# EAGLE design billdetector1d (EAGLE 5.11)
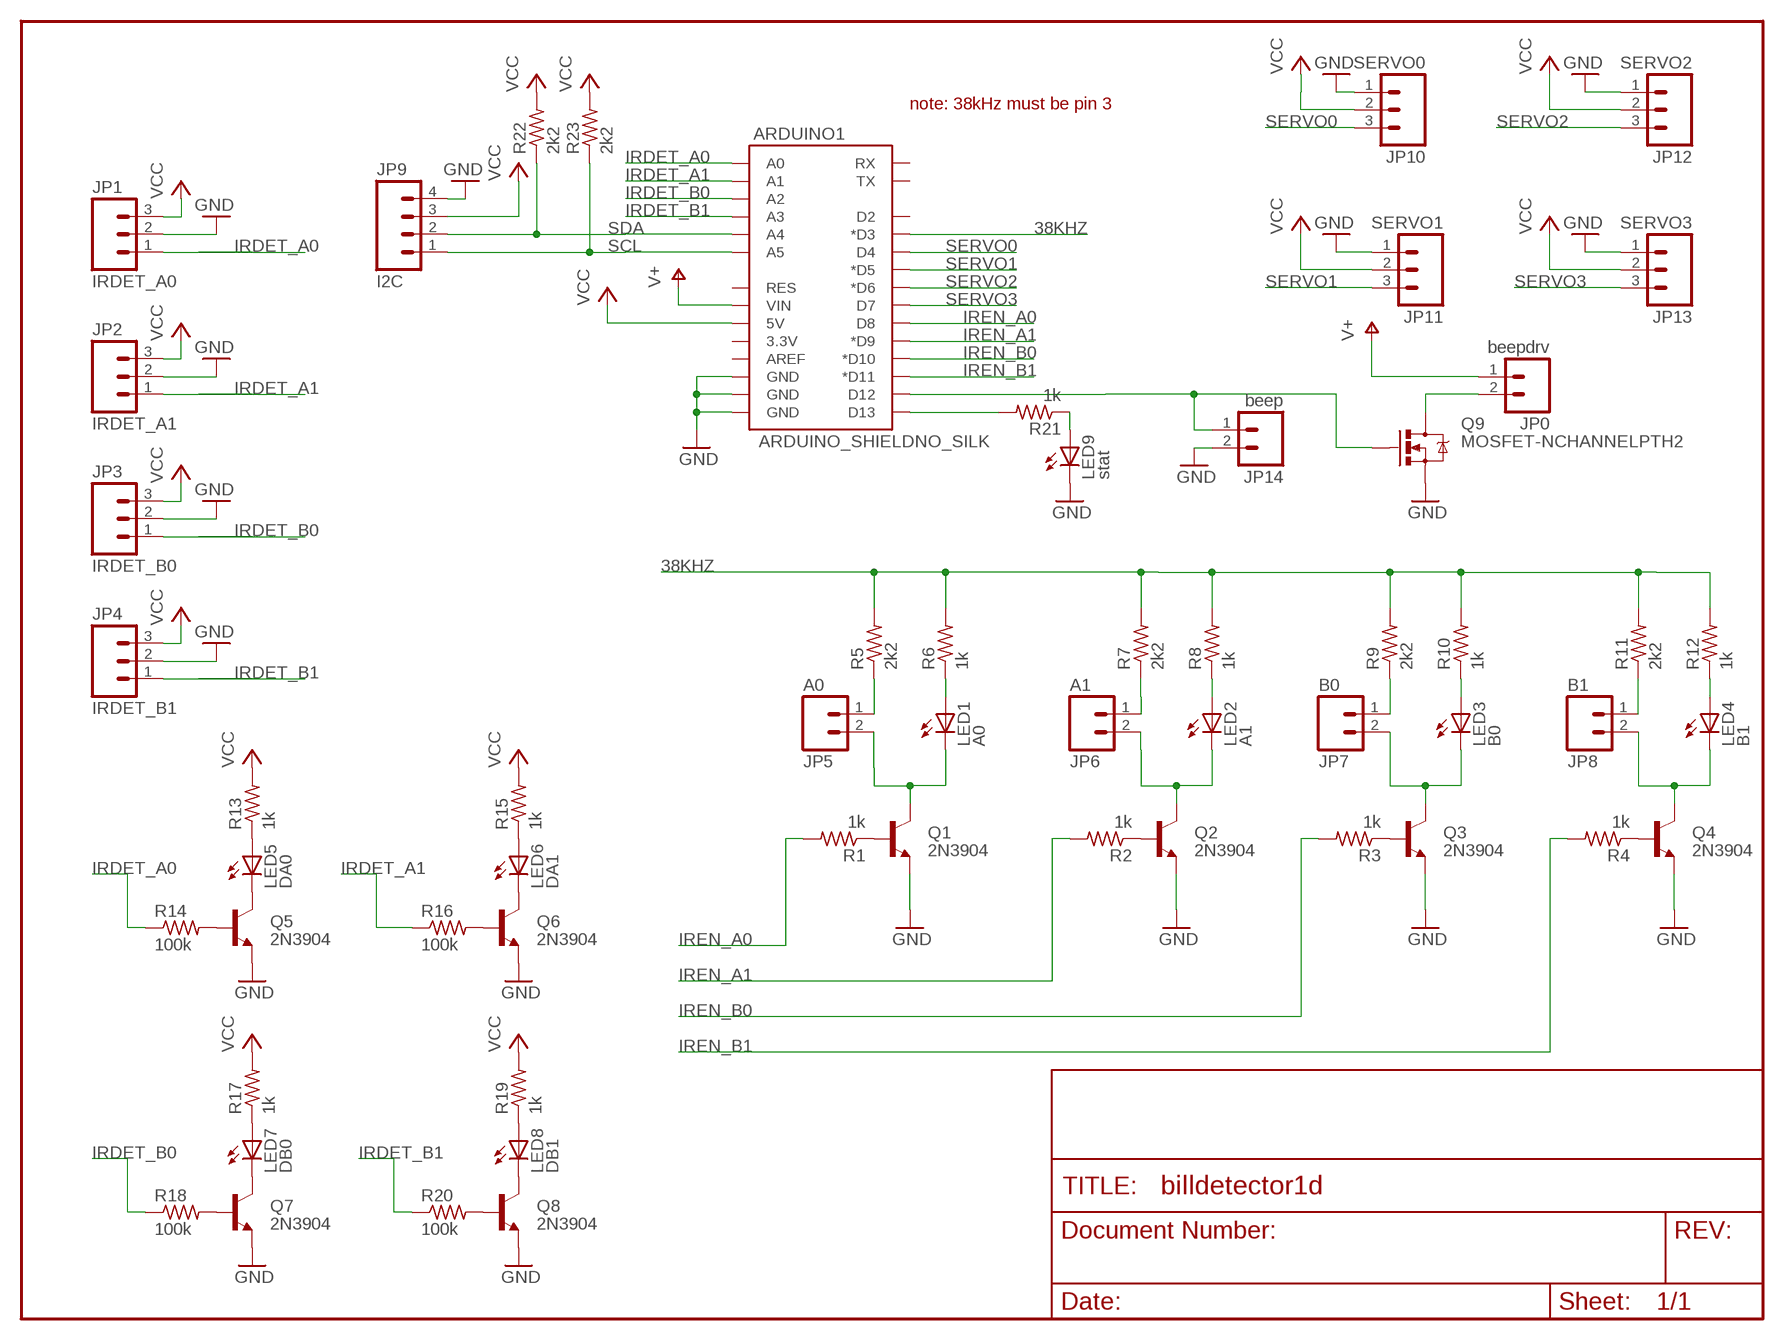
[diagram p0: schematic, sheet 1]

## Parts
ARDUINO1  ARDUINO_SHIELDNO_SILK  [DUEMILANOVE_VIAS]
JP0  beepdrv  M02POLAR_LOCK  [MOLEX-1X2_LOCK]
JP1  IRDET_A0  M03POLAR_LOCK  [MOLEX-1X3_LOCK]
JP2  IRDET_A1  M03POLAR_LOCK  [MOLEX-1X3_LOCK]
JP3  IRDET_B0  M03POLAR_LOCK  [MOLEX-1X3_LOCK]
JP4  IRDET_B1  M03POLAR_LOCK  [MOLEX-1X3_LOCK]
JP5  A0  M02POLAR_LOCK  [MOLEX-1X2_LOCK]
JP6  A1  M02POLAR_LOCK  [MOLEX-1X2_LOCK]
JP7  B0  M02POLAR_LOCK  [MOLEX-1X2_LOCK]
JP8  B1  M02POLAR_LOCK  [MOLEX-1X2_LOCK]
JP9  I2C  M04LOCK  [1X04_LOCK]
JP10  SERVO0  M03LOCK  [1X03_LOCK]
JP11  SERVO1  M03LOCK  [1X03_LOCK]
JP12  SERVO2  M03LOCK  [1X03_LOCK]
JP13  SERVO3  M03LOCK  [1X03_LOCK]
JP14  beep  M02LOCK  [1X02_LOCK]
LED1  A0  LED3MM  [LED3MM]
LED2  A1  LED3MM  [LED3MM]
LED3  B0  LED3MM  [LED3MM]
LED4  B1  LED3MM  [LED3MM]
LED5  DA0  LED3MM  [LED3MM]
LED6  DA1  LED3MM  [LED3MM]
LED7  DB0  LED3MM  [LED3MM]
LED8  DB1  LED3MM  [LED3MM]
LED9  stat  LED3MM  [LED3MM]
Q1  2N3904  TRANSISTOR_NPNTO92  [TO-92]
Q2  2N3904  TRANSISTOR_NPNTO92  [TO-92]
Q3  2N3904  TRANSISTOR_NPNTO92  [TO-92]
Q4  2N3904  TRANSISTOR_NPNTO92  [TO-92]
Q5  2N3904  TRANSISTOR_NPNTO92  [TO-92]
Q6  2N3904  TRANSISTOR_NPNTO92  [TO-92]
Q7  2N3904  TRANSISTOR_NPNTO92  [TO-92]
Q8  2N3904  TRANSISTOR_NPNTO92  [TO-92]
Q9  MOSFET-NCHANNELPTH2  [TO220V]
R1  1k  R-US_0204/2V  [0204V]
R2  1k  R-US_0204/2V  [0204V]
R3  1k  R-US_0204/2V  [0204V]
R4  1k  R-US_0204/2V  [0204V]
R5  2k2  R-US_0204/2V  [0204V]
R6  1k  R-US_0204/2V  [0204V]
R7  2k2  R-US_0204/2V  [0204V]
R8  1k  R-US_0204/2V  [0204V]
R9  2k2  R-US_0204/2V  [0204V]
R10  1k  R-US_0204/2V  [0204V]
R11  2k2  R-US_0204/2V  [0204V]
R12  1k  R-US_0204/2V  [0204V]
R13  1k  R-US_0204/2V  [0204V]
R14  100k  R-US_0204/2V  [0204V]
R15  1k  R-US_0204/2V  [0204V]
R16  100k  R-US_0204/2V  [0204V]
R17  1k  R-US_0204/2V  [0204V]
R18  100k  R-US_0204/2V  [0204V]
R19  1k  R-US_0204/2V  [0204V]
R20  100k  R-US_0204/2V  [0204V]
R21  1k  R-US_0204/2V  [0204V]
R22  2k2  R-US_0204/2V  [0204V]
R23  2k2  R-US_0204/2V  [0204V]

## Nets
38KHZ: ARDUINO1.D3(*D3) R5.2 R6.2 R7.2 R8.2 R9.2 R10.2 R11.2 R12.2
GND: ARDUINO1.GND@0(GND) ARDUINO1.GND@1(GND) ARDUINO1.GND@2(GND) JP1.2 JP2.2 JP3.2 JP4.2 JP9.4 JP10.1 JP11.1 JP12.1 JP13.1 JP14.2 LED9.K(C) Q1.1(E) Q2.1(E) Q3.1(E) Q4.1(E) Q5.1(E) Q6.1(E) Q7.1(E) Q8.1(E) Q9.3(S)
IRDET_A0: ARDUINO1.A0 JP1.1 R14.1
IRDET_A1: ARDUINO1.A1 JP2.1 R16.1
IRDET_B0: ARDUINO1.A2 JP3.1 R18.1
IRDET_B1: ARDUINO1.A3 JP4.1 R20.1
IREN_A0: ARDUINO1.D8 R1.2
IREN_A1: ARDUINO1.D9(*D9) R2.2
IREN_B0: ARDUINO1.D10(*D10) R3.2
IREN_B1: ARDUINO1.D11(*D11) R4.2
N$1: Q3.2(B) R3.1
N$2: Q4.2(B) R4.1
N$3: JP6.1 R7.1
N$4: JP5.2 LED1.K(C) Q1.3(C)
N$5: Q1.2(B) R1.1
N$6: Q2.2(B) R2.1
N$7: ARDUINO1.D12 JP14.1 Q9.1(G)
N$8: ARDUINO1.D13 R21.2
N$9: LED1.A R6.1
N$10: LED2.A R8.1
N$11: JP6.2 LED2.K(C) Q2.3(C)
N$12: LED5.A R13.1
N$13: JP5.1 R5.1
N$14: LED5.K(C) Q5.3(C)
N$15: LED3.A R10.1
N$16: LED4.A R12.1
N$17: JP7.1 R9.1
N$18: JP8.1 R11.1
N$19: JP7.2 LED3.K(C) Q3.3(C)
N$20: JP8.2 LED4.K(C) Q4.3(C)
N$21: Q5.2(B) R14.2
N$22: LED6.A R15.1
N$23: LED6.K(C) Q6.3(C)
N$24: Q6.2(B) R16.2
N$25: LED7.A R17.1
N$26: LED7.K(C) Q7.3(C)
N$27: Q8.2(B) R20.2
N$28: LED8.A R19.1
N$29: LED8.K(C) Q8.3(C)
N$30: Q7.2(B) R18.2
N$31: LED9.A R21.1
N$32: JP0.2 Q9.2(D)
SCL: ARDUINO1.A5 JP9.1 R23.1
SDA: ARDUINO1.A4 JP9.2 R22.1
SERVO0: ARDUINO1.D4 JP10.3
SERVO1: ARDUINO1.D5(*D5) JP11.3
SERVO2: ARDUINO1.D6(*D6) JP12.3
SERVO3: ARDUINO1.D7 JP13.3
V+: ARDUINO1.VIN JP0.1
VCC: ARDUINO1.5V JP1.3 JP2.3 JP3.3 JP4.3 JP9.3 JP10.2 JP11.2 JP12.2 JP13.2 R13.2 R15.2 R17.2 R19.2 R22.2 R23.2
Unconnected: ARDUINO1.3.3V ARDUINO1.AREF ARDUINO1.D2 ARDUINO1.RES ARDUINO1.RX ARDUINO1.TX

## Notes on the sheet
- note: 38kHz must be pin 3

## Library data of the parts
ARDUINO1 = SparkFun-20110517:ARDUINO_SHIELD
JP0 JP5-JP8 JP14 = SparkFun-20110517:M02: Header 2 Standard 2-pin 0.1" header. Use with straight break away headers (SKU : PRT-00116), right angle break away headers (PRT-00553), swiss pins (PRT-00743), machine pins (PRT-00117), and female headers (PRT-00115). Molex polarized connector foot print use with SKU : PRT-08233 with associated crimp pins and housings.
JP1-JP4 JP10-JP13 = SparkFun-20110517:M03: Header 3 Standard 3-pin 0.1" header. Use with straight break away headers (SKU : PRT-00116), right angle break away headers (PRT-00553), swiss pins (PRT-00743), machine pins (PRT-00117), and female headers (PRT-00115). Molex polarized connector foot print use with SKU : PRT-08232 with associated crimp pins and housings.
JP9 = SparkFun-20110517:M04: Header 4 Standard 4-pin 0.1" header. Use with straight break away headers (SKU : PRT-00116), right angle break away headers (PRT-00553), swiss pins (PRT-00743), machine pins (PRT-00117), and female headers (PRT-00115). Molex polarized connector foot print use with SKU : PRT-08231 with associated crimp pins and housings. 1MM SMD Version SKU: PRT-10208
LED1-LED9 = SparkFun-20110517:LED: LEDs Standard schematic elements and footprints for 5mm, 3mm, 1206, and 0603 sized LEDs. 5mm - Spark Fun Electronics SKU : COM-00529 (and others)
Q1-Q8 = SparkFun-20110517:TRANSISTOR_NPN: Transistor NPN BJT configuration in SOT23 package. MMBT2222 is the common NPN we use. Double check BCE configuration again layout.
Q9 = SparkFun-20110517:MOSFET-NCHANNEL
R1-R23 = rcl:R-US_: RESISTOR, American symbol

## Board
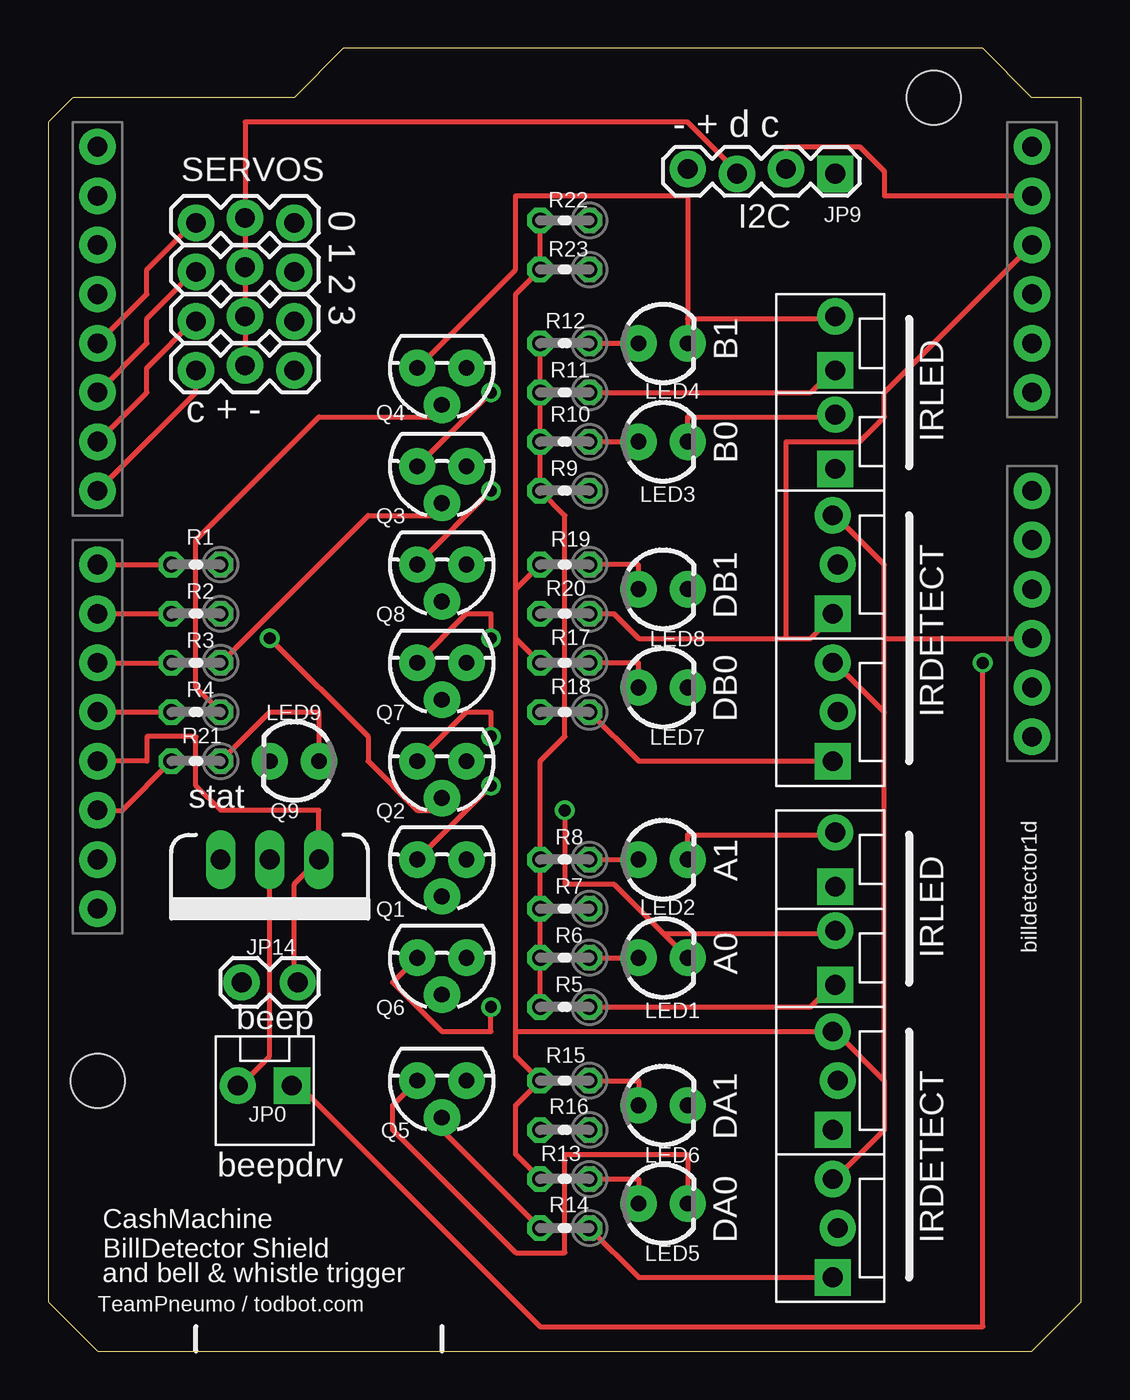
[diagram p1: board, top side]
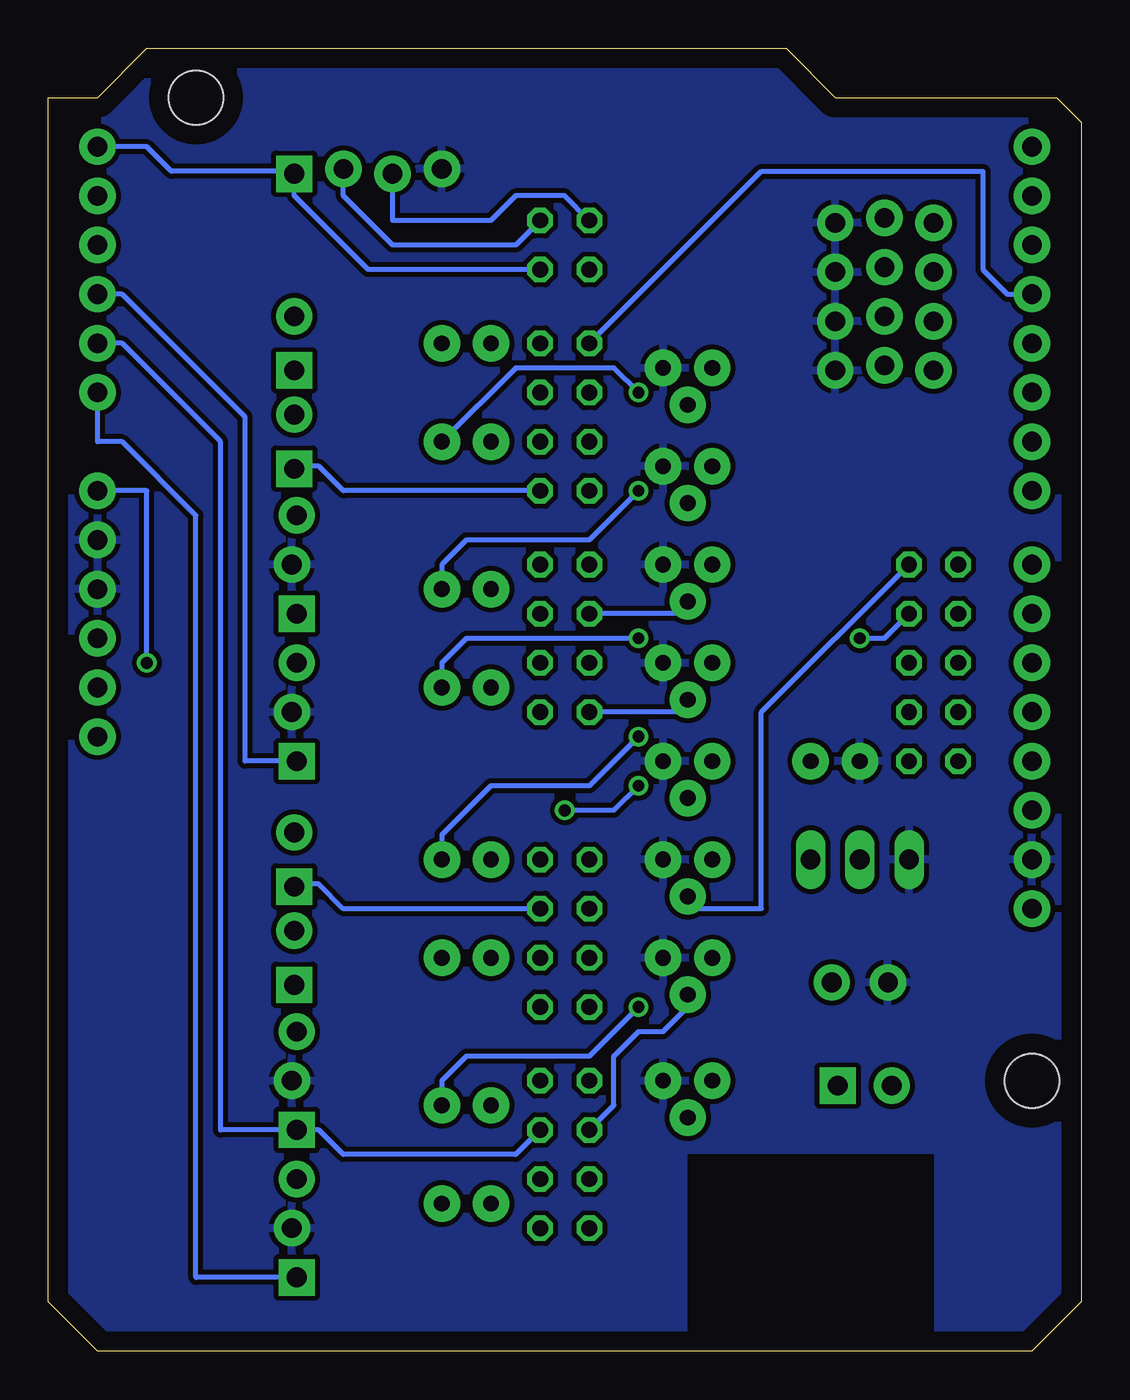
[diagram p2: board, bottom side, seen from below]

Size 53.34 x 67.31 mm. Coordinates in mm from the lower left corner, seen from the top.
Outline: 2.54,0 50.8,0 53.34,2.54 53.34,64.77 50.8,64.77 48.26,67.31 15.24,67.31 12.7,64.77 1.27,64.77 0,63.5 0,2.54 2.54,0
Copper layers (1*16): Top 0.035mm / dielectric 1.5mm / Bottom 0.035mm
Design rules "default *": minimum track width 10mil, minimum drill 24mil, track to track 10mil, track to pad 10mil, pad to pad 10mil, via to via 10mil, smd to smd 8mil, copper to edge 40mil, drill to drill 8mil, minimum pad ring 10mil, minimum via ring 8mil, stop-mask expansion 4mil, vias tented up to drill 0mil, thermal gap 10mil
Holes 2.8 mm at 45.72,64.77 2.54,13.97
bRestrict: area 7.6,0 to 20.3,10.2

### Footprints (pad centres in the part's own frame; a part is rotated, then mirrored left to right if it is on the bottom)
DUEMILANOVE_VIAS = drill 1.016 pad 1.88 round: 3.3V 50.8,13.97; 5V 50.8,16.51; A0 50.8,29.21; A1 50.8,31.75; A2 50.8,34.29; A3 50.8,36.83; A4 50.8,39.37; A5 50.8,41.91; AREF 2.54,2.54; D2 2.54,36.83; D3 2.54,34.29; D4 2.54,31.75; D5 2.54,29.21; D6 2.54,26.67; D7 2.54,24.13; D8 2.54,20.32; D9 2.54,17.78; D10 2.54,15.24; D11 2.54,12.7; D12 2.54,10.16; D13 2.54,7.62; GND@0 50.8,19.05; GND@1 50.8,21.59; GND@2 2.54,5.08; RES 50.8,11.43; RX 2.54,41.91; TX 2.54,39.37; VIN 50.8,24.13
MOLEX-1X2_LOCK = drill 1.016 pad 1.88 square: 1 -0.127,0 | drill 1.016 pad 1.88 round: 2 2.667,0
MOLEX-1X3_LOCK = drill 1.016 pad 1.88 square: 1 0,0.127 | drill 1.016 pad 1.88 round: 2 2.54,-0.127; 3 5.08,0.127
1X04_LOCK = drill 1.016 pad 1.88 square: 1 0,0.127 | drill 1.016 pad 1.88 round: 2 2.54,-0.127; 3 5.08,0.127; 4 7.62,-0.127
1X03_LOCK = drill 1.016 pad 1.88 round: 1 0,0.127; 2 2.54,-0.127; 3 5.08,0.127
1X02_LOCK = drill 1.016 pad 1.88 round: 1 -0.178,0; 2 2.718,0
LED3MM = drill 0.813 pad 1.88 round: A -1.27,0; K 1.27,0
TO-92 = drill 0.813 pad 1.88 round: 1 -1.27,0; 2 0,1.905; 3 1.27,0
TO220V = drill 1.016 long: 1 -2.54,0; 2 0,0; 3 2.54,0
0204V = drill 0.813 octagon: 1 -1.27,0; 2 1.27,0

### Placement (x,y rotation side)
ARDUINO1  0,20.32 0 top
JP0  12.45,13.72 180 top
JP1  40.64,3.81 90 top
JP2  40.64,11.43 90 top
JP3  40.64,30.48 90 top
JP4  40.64,38.1 90 top
JP5  40.64,19.05 90 top
JP6  40.64,24.13 90 top
JP7  40.64,45.72 90 top
JP8  40.64,50.8 90 top
JP9  40.64,60.96 180 top
JP10  12.7,58.42 180 top
JP11  12.7,55.88 180 top
JP12  12.7,53.34 180 top
JP13  12.7,50.8 180 top
JP14  12.7,19.05 180 top
LED1  31.75,20.32 0 top
LED2  31.75,25.4 0 top
LED3  31.75,46.99 0 top
LED4  31.75,52.07 0 top
LED5  31.75,7.62 0 top
LED6  31.75,12.7 0 top
LED7  31.75,34.29 0 top
LED8  31.75,39.37 0 top
LED9  12.7,30.48 180 top
Q1  20.32,25.4 180 top
Q2  20.32,30.48 180 top
Q3  20.32,45.72 180 top
Q4  20.32,50.8 180 top
Q5  20.32,13.97 180 top
Q6  20.32,20.32 180 top
Q7  20.32,35.56 180 top
Q8  20.32,40.64 180 top
Q9  11.43,25.4 180 top
R1  7.62,40.64 180 top
R2  7.62,38.1 180 top
R3  7.62,35.56 180 top
R4  7.62,33.02 180 top
R5  26.67,17.78 180 top
R6  26.67,20.32 180 top
R7  26.67,22.86 180 top
R8  26.67,25.4 180 top
R9  26.67,44.45 180 top
R10  26.67,46.99 180 top
R11  26.67,49.53 180 top
R12  26.67,52.07 180 top
R13  26.67,8.89 180 top
R14  26.67,6.35 180 top
R15  26.67,13.97 180 top
R16  26.67,11.43 180 top
R17  26.67,35.56 180 top
R18  26.67,33.02 180 top
R19  26.67,40.64 180 top
R20  26.67,38.1 180 top
R21  7.62,30.48 180 top
R22  26.67,58.42 180 top
R23  26.67,55.88 180 top

### Tracks (layer width: path | path; a pad name or v marks a point on that pad's centre or on a via)
38KHZ
  Top 0.254: R5.2 R6.2 R7.2 R8.2 25.4,30.48 26.67,31.75 26.67,43.18 R9.2 R10.2 R11.2 R12.2
  Bottom 0.254: ARDUINO1.D3 3.81,54.61 5.08,55.88 5.08,60.96 16.51,60.96 R12.2
GND
  pour Bottom: -1.27,-2.54 55.88,-2.54 54.61,68.58 -1.27,67.31
IRDET_A0
  Top 0.254: R14.1 30.48,3.81 JP1.1 | JP1.1 40.64,3.81 JP1.1
  Bottom 0.254: ARDUINO1.A0 50.8,46.99 49.53,46.99 45.72,43.18 45.72,3.81 40.64,3.81 JP1.1
IRDET_A1
  Bottom 0.254: R16.1 29.21,10.16 38.1,10.16 39.37,11.43 JP2.1 | JP2.1 40.64,11.43 | JP2.1 40.64,11.43 | ARDUINO1.A1 49.53,52.07 44.45,46.99 44.45,11.43 40.64,11.43 | JP2.1 40.64,11.43
IRDET_B0
  Top 0.254: R18.1 30.48,30.48 JP3.1 | JP3.1 40.64,30.48 JP3.1
  Bottom 0.254: ARDUINO1.A2 49.53,54.61 43.18,48.26 43.18,30.48 40.64,30.48 JP3.1
IRDET_B1
  Top 0.254: R20.1 29.21,38.1 30.48,36.83 38.1,36.83 | 38.1,36.83 39.37,36.83 40.64,38.1 JP4.1 | ARDUINO1.A3 43.18,49.53 43.18,48.26 41.91,46.99 38.1,46.99 38.1,36.83
IREN_A0
  Top 0.254: ARDUINO1.D8 R1.2
IREN_A1
  Top 0.254: ARDUINO1.D9 R2.2
IREN_B0
  Top 0.254: ARDUINO1.D10 R3.2
IREN_B1
  Top 0.254: ARDUINO1.D11 R4.2
N$1
  Top 0.254: R3.1 16.51,43.18 20.32,43.18 Q3.2
N$2
  Top 0.254: R4.1 7.62,34.29 7.62,41.91 13.97,48.26 20.32,48.26 Q4.2
N$3
  Bottom 0.254: R7.1 38.1,22.86 39.37,24.13 40.64,24.13 JP6.1
N$4  (via drill 0.61)
  Top 0.254: Q1.3 v22.86,29.21 | v26.67,27.94 26.67,24.13 29.21,24.13 31.75,21.59 | 31.75,21.59 LED1.K | 31.75,21.59 40.64,21.59 JP5.2
  Bottom 0.254: v22.86,29.21 24.13,27.94 v26.67,27.94
N$5
  Bottom 0.254: R1.1 16.51,33.02 16.51,22.86 20.32,22.86 Q1.2
N$6  (via drill 0.61)
  Top 0.254: v11.43,36.83 16.51,31.75 16.51,30.48 19.05,27.94 20.32,27.94 Q2.2
  Bottom 0.254: R2.1 10.16,36.83 v11.43,36.83
N$7
  Top 0.254: JP14.1 12.7,19.05 12.7,24.13 Q9.1 13.97,27.94 8.89,27.94 7.62,29.21 7.62,31.75 5.08,31.75 5.08,30.48 ARDUINO1.D12
N$8
  Top 0.254: R21.2 3.81,27.94 ARDUINO1.D13
N$9
  Top 0.254: R6.1 LED1.A
N$10
  Top 0.254: R8.1 LED2.A
N$11  (via drill 0.61)
  Top 0.254: Q2.3 21.59,33.02 22.86,33.02 v22.86,31.75 | LED2.K 33.02,26.67 40.64,26.67 JP6.2
  Bottom 0.254: v22.86,31.75 25.4,29.21 30.48,29.21 33.02,26.67 LED2.K
N$12
  Top 0.254: R13.1 30.48,8.89 LED5.A
N$13
  Top 0.254: R5.1 39.37,17.78 40.64,19.05 JP5.1
N$14
  Top 0.254: Q5.3 17.78,12.7 17.78,11.43 24.13,5.08 26.67,5.08 26.67,10.16 33.02,10.16 LED5.K
N$15
  Top 0.254: R10.1 LED3.A
N$16
  Top 0.254: R12.1 LED4.A
N$17
  Bottom 0.254: R9.1 38.1,44.45 39.37,45.72 40.64,45.72 JP7.1
N$18
  Top 0.254: R11.1 39.37,49.53 40.64,50.8 JP8.1
N$19  (via drill 0.61)
  Top 0.254: Q3.3 v22.86,49.53 | LED3.K 33.02,48.26 40.64,48.26 JP7.2
  Bottom 0.254: v22.86,49.53 24.13,50.8 29.21,50.8 LED3.K
N$20
  Top 0.254: Q4.3 24.13,55.88 24.13,59.69 33.02,59.69 33.02,53.34 | 33.02,53.34 LED4.K | 33.02,53.34 40.64,53.34 JP8.2
N$21
  Top 0.254: R14.2 20.32,11.43 Q5.2
N$22
  Top 0.254: R15.1 30.48,13.97 LED6.A
N$23  (via drill 0.61)
  Top 0.254: Q6.3 17.78,19.05 20.32,16.51 22.86,16.51 v22.86,17.78
  Bottom 0.254: v22.86,17.78 25.4,15.24 31.75,15.24 33.02,13.97 LED6.K
N$24
  Bottom 0.254: R16.2 24.13,12.7 24.13,15.24 22.86,16.51 21.59,16.51 20.32,17.78 Q6.2
N$25
  Top 0.254: R17.1 30.48,35.56 LED7.A
N$26  (via drill 0.61)
  Top 0.254: Q7.3 21.59,38.1 22.86,38.1 v22.86,36.83
  Bottom 0.254: v22.86,36.83 31.75,36.83 33.02,35.56 LED7.K
N$27
  Bottom 0.254: R20.2 20.32,38.1 Q8.2
N$28
  Top 0.254: R19.1 30.48,40.64 LED8.A
N$29  (via drill 0.61)
  Top 0.254: Q8.3 v22.86,44.45
  Bottom 0.254: v22.86,44.45 25.4,41.91 31.75,41.91 33.02,40.64 LED8.K
N$30
  Bottom 0.254: R18.2 20.32,33.02 Q7.2
N$31
  Top 0.254: R21.1 11.43,33.02 13.97,33.02 LED9.A
N$32
  Top 0.254: Q9.2 11.43,15.24 10.16,13.97 JP0.2
SCL
  Bottom 0.254: R23.1 36.83,55.88 40.64,59.69 JP9.1 | JP9.1 40.64,60.96 | JP9.1 40.64,60.96 | ARDUINO1.A5 48.26,62.23 46.99,60.96 40.64,60.96 | JP9.1 40.64,60.96
SDA
  Top 0.254: ARDUINO1.A4 43.18,59.69 43.18,60.96 41.91,62.23 38.1,62.23 JP9.2 | JP9.2 38.1,60.96 JP9.2
  Bottom 0.254: R22.1 29.21,57.15 35.56,57.15 38.1,59.69 38.1,60.96 JP9.2
SERVO0
  Top 0.254: ARDUINO1.D4 5.08,54.61 5.08,55.88 7.62,58.42 JP10.3
SERVO1
  Top 0.254: ARDUINO1.D5 5.08,52.07 5.08,53.34 7.62,55.88 JP11.3
SERVO2
  Top 0.254: ARDUINO1.D6 5.08,49.53 5.08,50.8 7.62,53.34 JP12.3
SERVO3
  Top 0.254: ARDUINO1.D7 7.62,49.53 JP13.3 | JP13.3 7.62,50.8 JP13.3
V+  (via drill 0.61)
  Top 0.254: v48.26,35.56 48.26,1.27 25.4,1.27 12.7,13.97 JP0.1
  Bottom 0.254: v48.26,35.56 48.26,44.45 ARDUINO1.VIN
VCC
  Top 0.254: 43.18,13.97 43.18,11.43 40.64,8.89 JP1.3 | 40.64,16.51 43.18,13.97 | JP2.3 40.64,16.51 | 43.18,33.02 40.64,35.56 JP3.3 | 43.18,13.97 43.18,33.02 | 43.18,33.02 43.18,36.83 | 43.18,36.83 43.18,40.64 40.64,43.18 JP4.3 | 43.18,36.83 ARDUINO1.5V | 10.16,53.34 JP13.2 | JP13.2 10.16,50.8 JP13.2 | JP12.2 10.16,53.34 | 10.16,58.42 JP11.2 | JP11.2 10.16,55.88 | JP11.2 10.16,55.88 | JP10.2 10.16,58.42 | JP10.2 10.16,58.42 | JP10.2 10.16,63.5 33.02,63.5 35.56,60.96 JP9.3 | JP10.2 10.16,58.42 | 10.16,55.88 JP12.2 | JP12.2 10.16,53.34 | JP12.2 10.16,53.34 | JP11.2 10.16,55.88 | R13.2 24.13,10.16 24.13,12.7 R15.2 24.13,15.24 24.13,16.51 | R22.2 R23.2 24.13,54.61 24.13,39.37 | 24.13,36.83 R17.2 | 24.13,36.83 24.13,39.37 | 24.13,39.37 R19.2 | 24.13,16.51 24.13,36.83 | 24.13,16.51 JP2.3 | JP2.3 40.64,16.51 | JP2.3 40.64,16.51
  Bottom 0.254: JP9.3 35.56,58.42 30.48,58.42 29.21,59.69 26.67,59.69 R22.2 | JP9.3 35.56,60.96 JP9.3

### Text on the board
tPlace: - + d c | SERVOS | 0 1 2 3 | c + - | IRLED | IRDETECT | billdetector1d | IRLED | CashMachine | IRDETECT | BillDetector Shield | and bell & whistle trigger | TeamPneumo / todbot.com
tValues: o - + | o - + | o - + | o - +